# Altium project head.PrjPcb
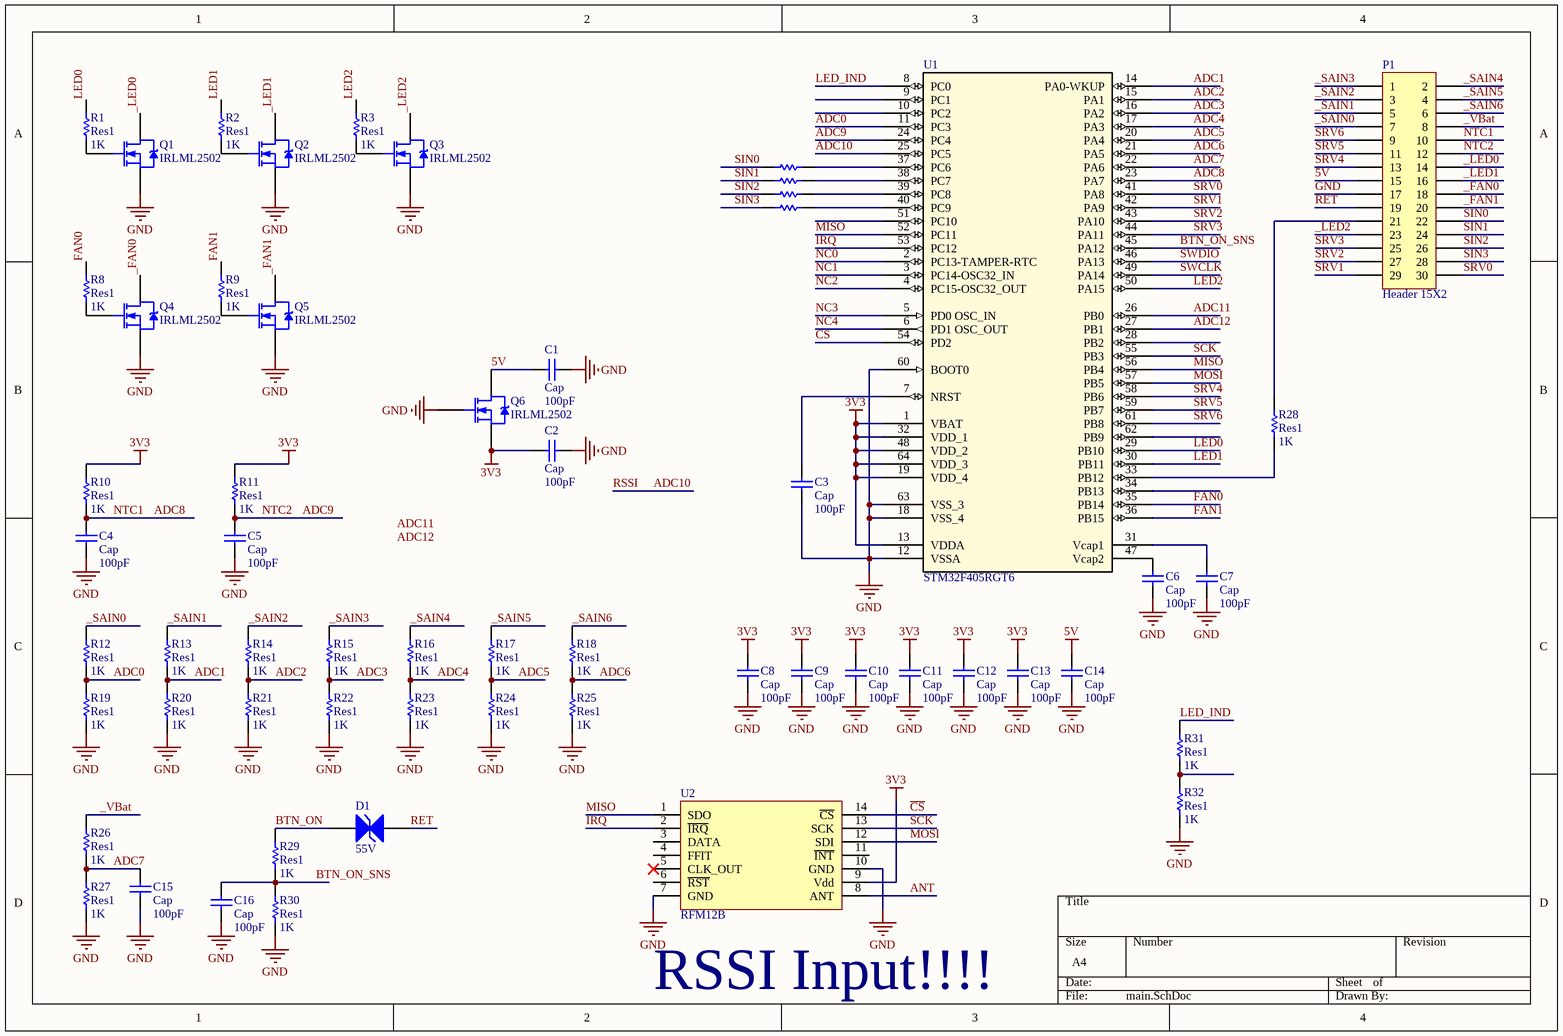
[diagram p0: main.SchDoc]
1 sheet, 58 parts. Net scope: global (net labels, ports and power ports of the same name join across sheets).
Board file: pcb.PcbDoc

## Sheet main.SchDoc
size A4

### Parts
C1  Cap  value 100pF  [RC_1210_T1.8]
C2  Cap  value 100pF  [RC_1210_T1.8]
C3  Cap  value 100pF  [RC_0603]
C4  Cap  value 100pF  [RC_0603]
C5  Cap  value 100pF  [RC_0603]
C6  Cap  value 100pF  [RC_0603]
C7  Cap  value 100pF  [RC_0603]
C8  Cap  value 100pF  [RC_0603]
C9  Cap  value 100pF  [RC_0603]
C10  Cap  value 100pF  [RC_0603]
C11  Cap  value 100pF  [RC_0603]
C12  Cap  value 100pF  [RC_0603]
C13  Cap  value 100pF  [RC_0603]
C14  Cap  value 100pF  [RC_0603]
C15  Cap  value 100pF  [RC_0603]
C16  Cap  value 100pF  [RC_0603]
D1  55V  [RR_SOD-323]
P1  Header 15X2  [HDR2X15-2mm]
Q1  IRLML2502  [RR_SOT-23]
Q2  IRLML2502  [RR_SOT-23]
Q3  IRLML2502  [RR_SOT-23]
Q4  IRLML2502  [RR_SOT-23]
Q5  IRLML2502  [RR_SOT-23]
Q6  IRLML2502  [RR_SOT-23]
R1  Res1  value 1K  [RR_0603]
R2  Res1  value 1K  [RR_0603]
R3  Res1  value 1K  [RR_0603]
R4  Res1  [RR_0603]  (value not drawn)
R5  Res1  [RR_0603]  (value not drawn)
R6  Res1  [RR_0603]  (value not drawn)
R7  Res1  [RR_0603]  (value not drawn)
R8  Res1  value 1K  [RR_0603]
R9  Res1  value 1K  [RR_0603]
R10  Res1  value 1K  [RR_0603]
R11  Res1  value 1K  [RR_0603]
R12  Res1  value 1K  [RR_0603]
R13  Res1  value 1K  [RR_0603]
R14  Res1  value 1K  [RR_0603]
R15  Res1  value 1K  [RR_0603]
R16  Res1  value 1K  [RR_0603]
R17  Res1  value 1K  [RR_0603]
R18  Res1  value 1K  [RR_0603]
R19  Res1  value 1K  [RR_0603]
R20  Res1  value 1K  [RR_0603]
R21  Res1  value 1K  [RR_0603]
R22  Res1  value 1K  [RR_0603]
R23  Res1  value 1K  [RR_0603]
R24  Res1  value 1K  [RR_0603]
R25  Res1  value 1K  [RR_0603]
R26  Res1  value 1K  [RR_0603]
R27  Res1  value 1K  [RR_0603]
R28  Res1  value 1K  [RR_0603]
R29  Res1  value 1K  [RR_0603]
R30  Res1  value 1K  [RR_0603]
R31  Res1  value 1K  [RR_0603]
R32  Res1  value 1K  [RR_0603]
U1  STM32F405RGT6  [RR_LQFP-64]
U2  RFM12B

### Nets
3V3: C2.2 C8.2 C9.2 C10.2 C11.2 C12.2 C13.2 Q6.2(S) R10.2 R11.2 U1.1(VBAT) U1.13(VDDA) U1.19(VDD_4) U1.32(VDD_1) U1.48(VDD_2) U1.64(VDD_3) U2.9(Vdd)
5V: C1.2 C14.2 P1.15 Q6.3(D)
GND: C1.1 C2.1 C3.1 C4.1 C5.1 C6.1 C7.1 C8.1 C9.1 C10.1 C11.1 C12.1 C13.1 C14.1 C15.1 C16.1 P1.17 Q1.2(S) Q2.2(S) Q3.2(S) Q4.2(S) Q5.2(S) Q6.1(G) R19.1 R20.1 R21.1 R22.1 R23.1 R24.1 R25.1 R27.1 R30.1 R32.1 U1.12(VSSA) U1.18(VSS_4) U1.60(BOOT0) U1.63(VSS_3) U2.7(GND) U2.10(GND)
_FAN0: P1.18 Q4.3(D)
_FAN1: P1.20 Q5.3(D)
_LED0: P1.14 Q1.3(D)
_LED1: P1.16 Q2.3(D)
_LED2: P1.23 Q3.3(D)
_SAIN0: P1.7 R12.2
_SAIN1: P1.5 R13.2
_SAIN2: P1.3 R14.2
_SAIN3: P1.1 R15.2
_SAIN4: P1.2 R16.2
_SAIN5: P1.4 R17.2
_SAIN6: P1.6 R18.2
_VBat: P1.8 R26.2
ADC0: R12.1 R19.2 U1.11(PC3)
ADC1: R13.1 R20.2 U1.14(PA0-WKUP)
ADC2: R14.1 R21.2 U1.15(PA1)
ADC3: R15.1 R22.2 U1.16(PA2)
ADC4: R16.1 R23.2 U1.17(PA3)
ADC5: R17.1 R24.2 U1.20(PA4)
ADC6: R18.1 R25.2 U1.21(PA5)
ADC7: C15.2 R26.1 R27.2 U1.22(PA6)
ADC8: C4.2 P1.10 R10.1 U1.23(PA7)  [also labelled NTC1]
ADC9: C5.2 P1.12 R11.1 U1.24(PC4)  [also labelled NTC2]
ADC10: U1.25(PC5)  [also labelled RSSI]
ADC11: U1.26(PB0)
ADC12: U1.27(PB1)
ANT: U2.8(ANT)
BTN_ON: D1.1(A) R29.2
BTN_ON_SNS: C16.2 R29.1 R30.2 U1.45(PA12)
~{CS}: U1.54(PD2) U2.14(~{CS})
FAN0: R8.2 U1.35(PB14)
FAN1: R9.2 U1.36(PB15)
~{IRQ}: U1.53(PC12) U2.2(~{IRQ})
LED0: R1.2 U1.29(PB10)
LED1: R2.2 U1.30(PB11)
LED2: R3.2 U1.50(PA15)
LED_IND: R31.2 U1.8(PC0)
MISO: U1.52(PC11) U1.56(PB4) U2.1(SDO)
MOSI: U1.57(PB5) U2.12(SDI)
NC0: U1.2(PC13-TAMPER-RTC)
NC1: U1.3(PC14-OSC32_IN)
NC2: U1.4(PC15-OSC32_OUT)
NC3: U1.5(PD0_OSC_IN)
NC4: U1.6(PD1_OSC_OUT)
RET: D1.2(A) P1.19
SCK: U1.55(PB3) U2.13(SCK)
SIN0: P1.22 R4.2
SIN1: P1.24 R5.2
SIN2: P1.26 R6.2
SIN3: P1.28 R7.2
SRV0: P1.30 U1.41(PA8)
SRV1: P1.29 U1.42(PA9)
SRV2: P1.27 U1.43(PA10)
SRV3: P1.25 U1.44(PA11)
SRV4: P1.13 U1.58(PB6)
SRV5: P1.11 U1.59(PB7)
SRV6: P1.9 U1.61(PB8)
SWCLK: U1.49(PA14)
SWDIO: U1.46(PA13)
NetC3_2: C3.2 U1.7(NRST)
NetC6_2: C6.2 U1.47(Vcap2)
NetC7_2: C7.2 U1.31(Vcap1)
NetP1_21: P1.21 R28.2
NetQ1_1: Q1.1(G) R1.1
NetQ2_1: Q2.1(G) R2.1
NetQ3_1: Q3.1(G) R3.1
NetQ4_1: Q4.1(G) R8.1
NetQ5_1: Q5.1(G) R9.1
NetR4_1: R4.1 U1.37(PC6)
NetR5_1: R5.1 U1.38(PC7)
NetR6_1: R6.1 U1.39(PC8)
NetR7_1: R7.1 U1.40(PC9)
NetR28_1: R28.1 U1.33(PB12)
NetR31_1: R31.1 R32.2

Not connected (* = marked no-connect by the designer): U1 9(PC1) 10(PC2) 28(PB2) 34(PB13) 51(PC10) 62(PB9); U2 3(DATA) 4(FFIT) 5(CLK_OUT)* 6(~{RST}) 11(~{INT})

### Notes on the sheet
- (near U2) RSSI Input!!!!
- Labels drawn without touching a wire or pin: ADC11, ADC12

### Library data of the parts
C1-C16 = Cap: Capacitor; Published: 8-Jun-2000; LatestRevisionDate: 17-Jul-2002; LatestRevisionNote: Re-released for DXP Platform.; PackageReference: RAD-0.3; Publisher: Altium Limited; PackageDescription: Radial Cap, Thru-Hole; 2 Leads; 0.3 in Pin Spacing
D1 = D55V0M1B2WS-7: DIODE TVS 55V; Manufacturer: Diodes Incorporated; Value: TVS DIODE 55VWM 100VC; Order Number: D55V0M1B2WS-7; Package: SOD-323; Cost: 0,48
P1 = Header 15X2: Header, 15-Pin, Dual row; LatestRevisionDate: 17-Jul-2002; LatestRevisionNote: Re-released for DXP Platform.; Publisher: Altium Limited
Q1-Q6 = IRLML2502: MOSFET N-CH 20V 4.2A SOT-23-3; Manufacturer: Infineon Technologies; Order Number: IRLML2502GTRPBF ( IRLML6246TRPBF (INFIN)); Cost: 0,52; Package: SOT-23; Value: MOSFET N-CH 20V 4.2A SOT-23-3
R1-R3 R8-R32 = Res1: Resistor; Published: 8-Jun-2000; LatestRevisionDate: 17-Jul-2002; LatestRevisionNote: Re-released for DXP Platform.; PackageReference: AXIAL-0.3; Publisher: Altium Limited; PackageDescription: Axial Device, Thru-Hole; 2 Leads; 0.3 in Pin Spacing
R4-R7 = Res1: Resistor; Value: 1K; Published: 8-Jun-2000; LatestRevisionDate: 17-Jul-2002; LatestRevisionNote: Re-released for DXP Platform.; PackageReference: AXIAL-0.3; Publisher: Altium Limited; PackageDescription: Axial Device, Thru-Hole; 2 Leads; 0.3 in Pin Spacing
U1 = STM32F405RGT6: MCU STM32F405RGT6; Manufacturer: ST Microelectronics; Value: IC MCU 32BIT 1MB FLASH 64LQFP; Order Number: STM32F405RGT6; Cost: 10,58; Package: 64-LQFP
U2 = Component_1